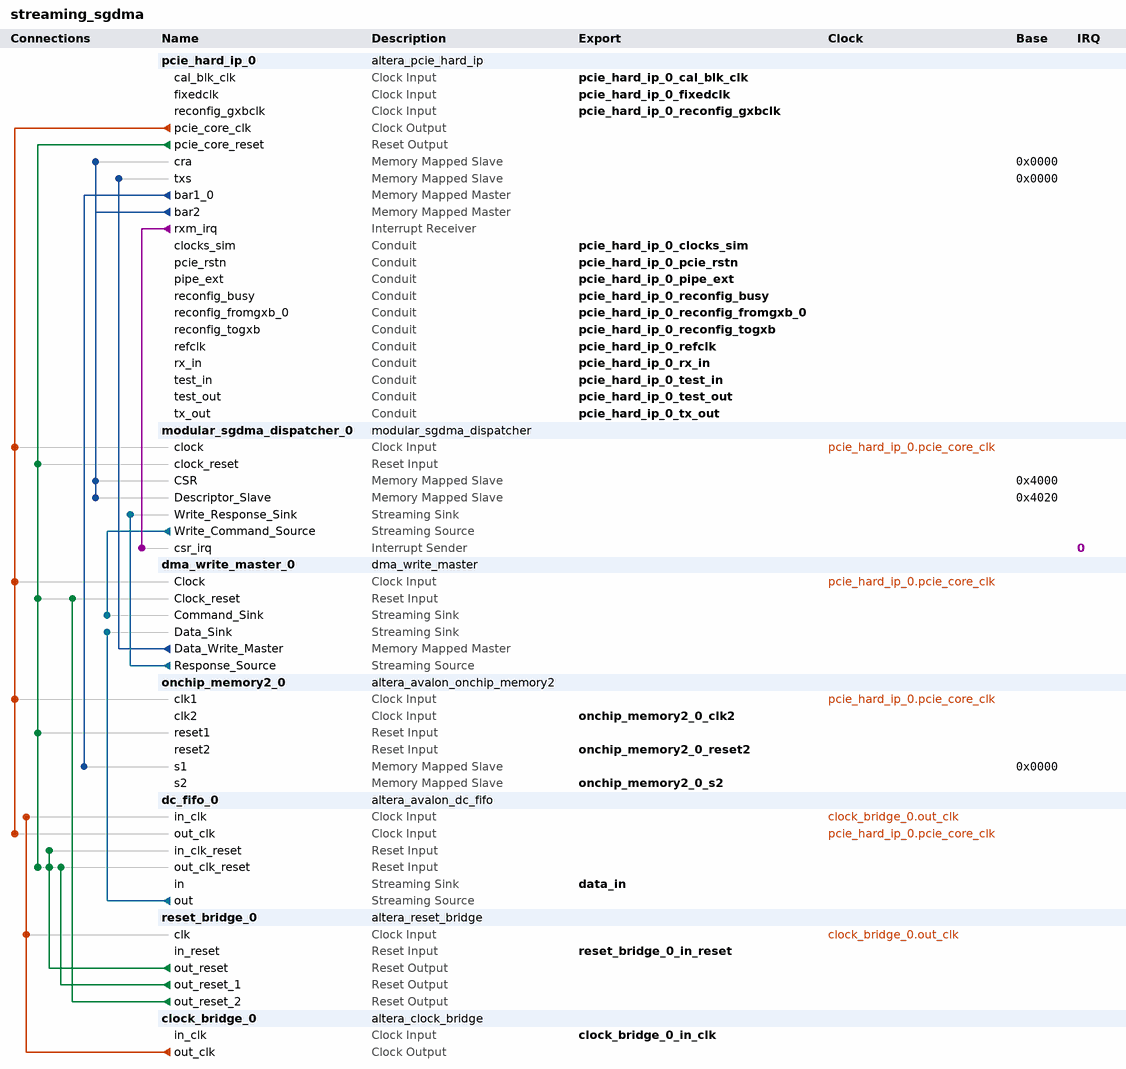
[diagram p0: system contents]
# Platform Designer (Qsys) system streaming_sgdma, Arria II GX EP2AGX125EF35C4
# Parameters at their usual value, and those the tool derives, are not listed.
package require -exact qsys 13.1
create_system streaming_sgdma
set_project_property DEVICE_FAMILY {Arria II GX}
set_project_property DEVICE EP2AGX125EF35C4

add_instance pcie_hard_ip_0 altera_pcie_hard_ip 13.1
set_instance_parameter_value pcie_hard_ip_0 max_link_width 4
set_instance_parameter_value pcie_hard_ip_0 p_pcie_test_out_width 64bits
set_instance_parameter_value pcie_hard_ip_0 {BAR Type} {64 bit Prefetchable,Not used,32 bit Non-Prefetchable,Not used,Not used,Not used}
set_instance_parameter_value pcie_hard_ip_0 vendor_id 4466
set_instance_parameter_value pcie_hard_ip_0 device_id 47950
set_instance_parameter_value pcie_hard_ip_0 class_code 16711680
set_instance_parameter_value pcie_hard_ip_0 subsystem_vendor_id 4466
set_instance_parameter_value pcie_hard_ip_0 subsystem_device_id 4
set_instance_parameter_value pcie_hard_ip_0 my_advanced_errors false
set_instance_parameter_value pcie_hard_ip_0 my_enable_ecrc_check false
set_instance_parameter_value pcie_hard_ip_0 my_enable_ecrc_gen false
set_instance_parameter_value pcie_hard_ip_0 max_payload_size 1
set_instance_parameter_value pcie_hard_ip_0 CG_NO_CPL_REORDERING 0
set_instance_parameter_value pcie_hard_ip_0 CG_ENABLE_A2P_INTERRUPT 0
set_instance_parameter_value pcie_hard_ip_0 p_user_msi_enable 0
set_instance_parameter_value pcie_hard_ip_0 CB_A2P_ADDR_MAP_IS_FIXED 0
set_instance_parameter_value pcie_hard_ip_0 CB_A2P_ADDR_MAP_NUM_ENTRIES 16
set_instance_parameter_value pcie_hard_ip_0 CB_A2P_ADDR_MAP_PASS_THRU_BITS 20
set_instance_parameter_value pcie_hard_ip_0 {PCIe Address 63:32} 0x00000000,0x00000000,0x00000000,0x00000000,0x00000000,0x00000000,0x00000000,0x00000000,0x00000000,0x00000000,0x00000000,0x00000000,0x00000000,0x00000000,0x00000000,0x00000000
set_instance_parameter_value pcie_hard_ip_0 {PCIe Address 31:0} 0x00000000,0x00000000,0x00000000,0x00000000,0x00000000,0x00000000,0x00000000,0x00000000,0x00000000,0x00000000,0x00000000,0x00000000,0x00000000,0x00000000,0x00000000,0x00000000

add_instance modular_sgdma_dispatcher_0 modular_sgdma_dispatcher 1.0
set_instance_parameter_value modular_sgdma_dispatcher_0 MODE 2
set_instance_parameter_value modular_sgdma_dispatcher_0 GUI_RESPONSE_PORT 2
set_instance_parameter_value modular_sgdma_dispatcher_0 DESCRIPTOR_FIFO_DEPTH 128
set_instance_parameter_value modular_sgdma_dispatcher_0 ENHANCED_FEATURES 0
set_instance_parameter_value modular_sgdma_dispatcher_0 CSR_ADDRESS_WIDTH 3

add_instance dma_write_master_0 dma_write_master 1.0
set_instance_parameter_value dma_write_master_0 DATA_WIDTH 64
set_instance_parameter_value dma_write_master_0 LENGTH_WIDTH 21
set_instance_parameter_value dma_write_master_0 FIFO_DEPTH 256
set_instance_parameter_value dma_write_master_0 STRIDE_ENABLE 0
set_instance_parameter_value dma_write_master_0 GUI_STRIDE_WIDTH 1
set_instance_parameter_value dma_write_master_0 BURST_ENABLE 1
set_instance_parameter_value dma_write_master_0 GUI_MAX_BURST_COUNT 32
set_instance_parameter_value dma_write_master_0 GUI_PROGRAMMABLE_BURST_ENABLE 0
set_instance_parameter_value dma_write_master_0 GUI_BURST_WRAPPING_SUPPORT 0
set_instance_parameter_value dma_write_master_0 TRANSFER_TYPE {Full Word Accesses Only}
set_instance_parameter_value dma_write_master_0 PACKET_ENABLE 0
set_instance_parameter_value dma_write_master_0 ERROR_ENABLE 0
set_instance_parameter_value dma_write_master_0 ERROR_WIDTH 8
set_instance_parameter_value dma_write_master_0 ADDRESS_WIDTH 24
set_instance_parameter_value dma_write_master_0 FIFO_SPEED_OPTIMIZATION 1

add_instance onchip_memory2_0 altera_avalon_onchip_memory2 13.1
set_instance_parameter_value onchip_memory2_0 dataWidth 32
set_instance_parameter_value onchip_memory2_0 dualPort true
set_instance_parameter_value onchip_memory2_0 initMemContent false
set_instance_parameter_value onchip_memory2_0 initializationFileName onchip_mem.hex
set_instance_parameter_value onchip_memory2_0 memorySize 65536

add_instance dc_fifo_0 altera_avalon_dc_fifo 13.1
set_instance_parameter_value dc_fifo_0 SYMBOLS_PER_BEAT 2
set_instance_parameter_value dc_fifo_0 BITS_PER_SYMBOL 8
set_instance_parameter_value dc_fifo_0 FIFO_DEPTH 256
set_instance_parameter_value dc_fifo_0 USE_PACKETS 0
set_instance_parameter_value dc_fifo_0 WR_SYNC_DEPTH 2
set_instance_parameter_value dc_fifo_0 RD_SYNC_DEPTH 2

add_instance reset_bridge_0 altera_reset_bridge 13.1
set_instance_parameter_value reset_bridge_0 ACTIVE_LOW_RESET 0
set_instance_parameter_value reset_bridge_0 SYNCHRONOUS_EDGES deassert
set_instance_parameter_value reset_bridge_0 NUM_RESET_OUTPUTS 3

add_instance clock_bridge_0 altera_clock_bridge 13.1
set_instance_parameter_value clock_bridge_0 DERIVED_CLOCK_RATE 0
set_instance_parameter_value clock_bridge_0 EXPLICIT_CLOCK_RATE 200000000

# connections
add_connection clock_bridge_0.out_clk dc_fifo_0.in_clk clock
add_connection clock_bridge_0.out_clk reset_bridge_0.clk clock
add_connection pcie_hard_ip_0.pcie_core_clk dc_fifo_0.out_clk clock
add_connection pcie_hard_ip_0.pcie_core_clk dma_write_master_0.Clock clock
add_connection pcie_hard_ip_0.pcie_core_clk modular_sgdma_dispatcher_0.clock clock
add_connection pcie_hard_ip_0.pcie_core_clk onchip_memory2_0.clk1 clock
add_connection pcie_hard_ip_0.pcie_core_reset dc_fifo_0.out_clk_reset reset
add_connection pcie_hard_ip_0.pcie_core_reset dma_write_master_0.Clock_reset reset
add_connection pcie_hard_ip_0.pcie_core_reset modular_sgdma_dispatcher_0.clock_reset reset
add_connection pcie_hard_ip_0.pcie_core_reset onchip_memory2_0.reset1 reset
add_connection reset_bridge_0.out_reset dc_fifo_0.in_clk_reset reset
add_connection reset_bridge_0.out_reset dc_fifo_0.out_clk_reset reset
add_connection reset_bridge_0.out_reset_1 dc_fifo_0.out_clk_reset reset
add_connection reset_bridge_0.out_reset_2 dma_write_master_0.Clock_reset reset
add_connection dma_write_master_0.Data_Write_Master pcie_hard_ip_0.txs avalon
set_connection_parameter_value dma_write_master_0.Data_Write_Master/pcie_hard_ip_0.txs baseAddress 0x0000
add_connection pcie_hard_ip_0.bar1_0 onchip_memory2_0.s1 avalon
set_connection_parameter_value pcie_hard_ip_0.bar1_0/onchip_memory2_0.s1 baseAddress 0x0000
add_connection pcie_hard_ip_0.bar2 modular_sgdma_dispatcher_0.CSR avalon
set_connection_parameter_value pcie_hard_ip_0.bar2/modular_sgdma_dispatcher_0.CSR baseAddress 0x4000
add_connection pcie_hard_ip_0.bar2 modular_sgdma_dispatcher_0.Descriptor_Slave avalon
set_connection_parameter_value pcie_hard_ip_0.bar2/modular_sgdma_dispatcher_0.Descriptor_Slave baseAddress 0x4020
add_connection pcie_hard_ip_0.bar2 pcie_hard_ip_0.cra avalon
set_connection_parameter_value pcie_hard_ip_0.bar2/pcie_hard_ip_0.cra baseAddress 0x0000
add_connection dc_fifo_0.out dma_write_master_0.Data_Sink avalon_streaming
add_connection dma_write_master_0.Response_Source modular_sgdma_dispatcher_0.Write_Response_Sink avalon_streaming
add_connection modular_sgdma_dispatcher_0.Write_Command_Source dma_write_master_0.Command_Sink avalon_streaming
add_connection pcie_hard_ip_0.rxm_irq modular_sgdma_dispatcher_0.csr_irq interrupt
set_connection_parameter_value pcie_hard_ip_0.rxm_irq/modular_sgdma_dispatcher_0.csr_irq irqNumber 0

# exported interfaces
add_interface pcie_hard_ip_0_cal_blk_clk clock sink
set_interface_property pcie_hard_ip_0_cal_blk_clk EXPORT_OF pcie_hard_ip_0.cal_blk_clk
add_interface pcie_hard_ip_0_refclk conduit end
set_interface_property pcie_hard_ip_0_refclk EXPORT_OF pcie_hard_ip_0.refclk
add_interface pcie_hard_ip_0_test_in conduit end
set_interface_property pcie_hard_ip_0_test_in EXPORT_OF pcie_hard_ip_0.test_in
add_interface pcie_hard_ip_0_pcie_rstn conduit end
set_interface_property pcie_hard_ip_0_pcie_rstn EXPORT_OF pcie_hard_ip_0.pcie_rstn
add_interface pcie_hard_ip_0_reconfig_busy conduit end
set_interface_property pcie_hard_ip_0_reconfig_busy EXPORT_OF pcie_hard_ip_0.reconfig_busy
add_interface pcie_hard_ip_0_pipe_ext conduit end
set_interface_property pcie_hard_ip_0_pipe_ext EXPORT_OF pcie_hard_ip_0.pipe_ext
add_interface pcie_hard_ip_0_clocks_sim conduit end
set_interface_property pcie_hard_ip_0_clocks_sim EXPORT_OF pcie_hard_ip_0.clocks_sim
add_interface pcie_hard_ip_0_test_out conduit end
set_interface_property pcie_hard_ip_0_test_out EXPORT_OF pcie_hard_ip_0.test_out
add_interface pcie_hard_ip_0_rx_in conduit end
set_interface_property pcie_hard_ip_0_rx_in EXPORT_OF pcie_hard_ip_0.rx_in
add_interface pcie_hard_ip_0_tx_out conduit end
set_interface_property pcie_hard_ip_0_tx_out EXPORT_OF pcie_hard_ip_0.tx_out
add_interface pcie_hard_ip_0_reconfig_togxb conduit end
set_interface_property pcie_hard_ip_0_reconfig_togxb EXPORT_OF pcie_hard_ip_0.reconfig_togxb
add_interface pcie_hard_ip_0_reconfig_gxbclk clock sink
set_interface_property pcie_hard_ip_0_reconfig_gxbclk EXPORT_OF pcie_hard_ip_0.reconfig_gxbclk
add_interface pcie_hard_ip_0_reconfig_fromgxb_0 conduit end
set_interface_property pcie_hard_ip_0_reconfig_fromgxb_0 EXPORT_OF pcie_hard_ip_0.reconfig_fromgxb_0
add_interface pcie_hard_ip_0_fixedclk clock sink
set_interface_property pcie_hard_ip_0_fixedclk EXPORT_OF pcie_hard_ip_0.fixedclk
add_interface onchip_memory2_0_clk2 clock sink
set_interface_property onchip_memory2_0_clk2 EXPORT_OF onchip_memory2_0.clk2
add_interface onchip_memory2_0_s2 avalon slave
set_interface_property onchip_memory2_0_s2 EXPORT_OF onchip_memory2_0.s2
add_interface onchip_memory2_0_reset2 reset sink
set_interface_property onchip_memory2_0_reset2 EXPORT_OF onchip_memory2_0.reset2
add_interface data_in avalon_streaming sink
set_interface_property data_in EXPORT_OF dc_fifo_0.in
add_interface reset_bridge_0_in_reset reset sink
set_interface_property reset_bridge_0_in_reset EXPORT_OF reset_bridge_0.in_reset
add_interface clock_bridge_0_in_clk clock sink
set_interface_property clock_bridge_0_in_clk EXPORT_OF clock_bridge_0.in_clk

set_interconnect_requirement {$system} qsys_mm.clockCrossingAdapter FIFO
set_interconnect_requirement {$system} qsys_mm.maxAdditionalLatency 2
set_interconnect_requirement {$system} qsys_mm.insertDefaultSlave false

save_system streaming_sgdma.qsys
